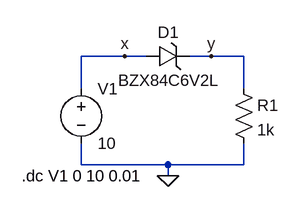
[diagram p0: schematic zener fwd_S20210020323.asc]
zener fwd_S20210020323.asc, the LTspice schematic file:
Version 4
SHEET 1 880 680
WIRE 80 80 16 80
WIRE 112 80 80 80
WIRE 208 80 176 80
WIRE 256 80 208 80
WIRE 16 128 16 80
WIRE 256 128 256 80
WIRE 16 240 16 208
WIRE 144 240 16 240
WIRE 256 240 256 208
WIRE 256 240 144 240
WIRE 144 256 144 240
FLAG 144 256 0
FLAG 80 80 x
FLAG 208 80 y
SYMBOL voltage 16 112 R0
WINDOW 123 0 0 Left 0
WINDOW 39 0 0 Left 0
SYMATTR InstName V1
SYMATTR Value 10
SYMBOL res 240 112 R0
SYMATTR InstName R1
SYMATTR Value 1k
SYMBOL zener 112 96 R270
WINDOW 0 36 32 VTop 2
WINDOW 3 -4 32 VBottom 2
SYMATTR InstName D1
SYMATTR Value BZX84C6V2L
SYMATTR Description Diode
SYMATTR Type diode
TEXT -72 256 Left 2 !.dc V1 0 10 0.01

The netlist it stands for:
* zener fwd_S20210020323.asc
V1 x 0 10
R1 y 0 1k
D1 x y BZX84C6V2L
.model D D
.lib standard.dio
.dc V1 0 10 0.01
.backanno
.end